# EAGLE design SparkFun_Ambient_Light_Sensor_VEML6030 (EAGLE 9.4.0)
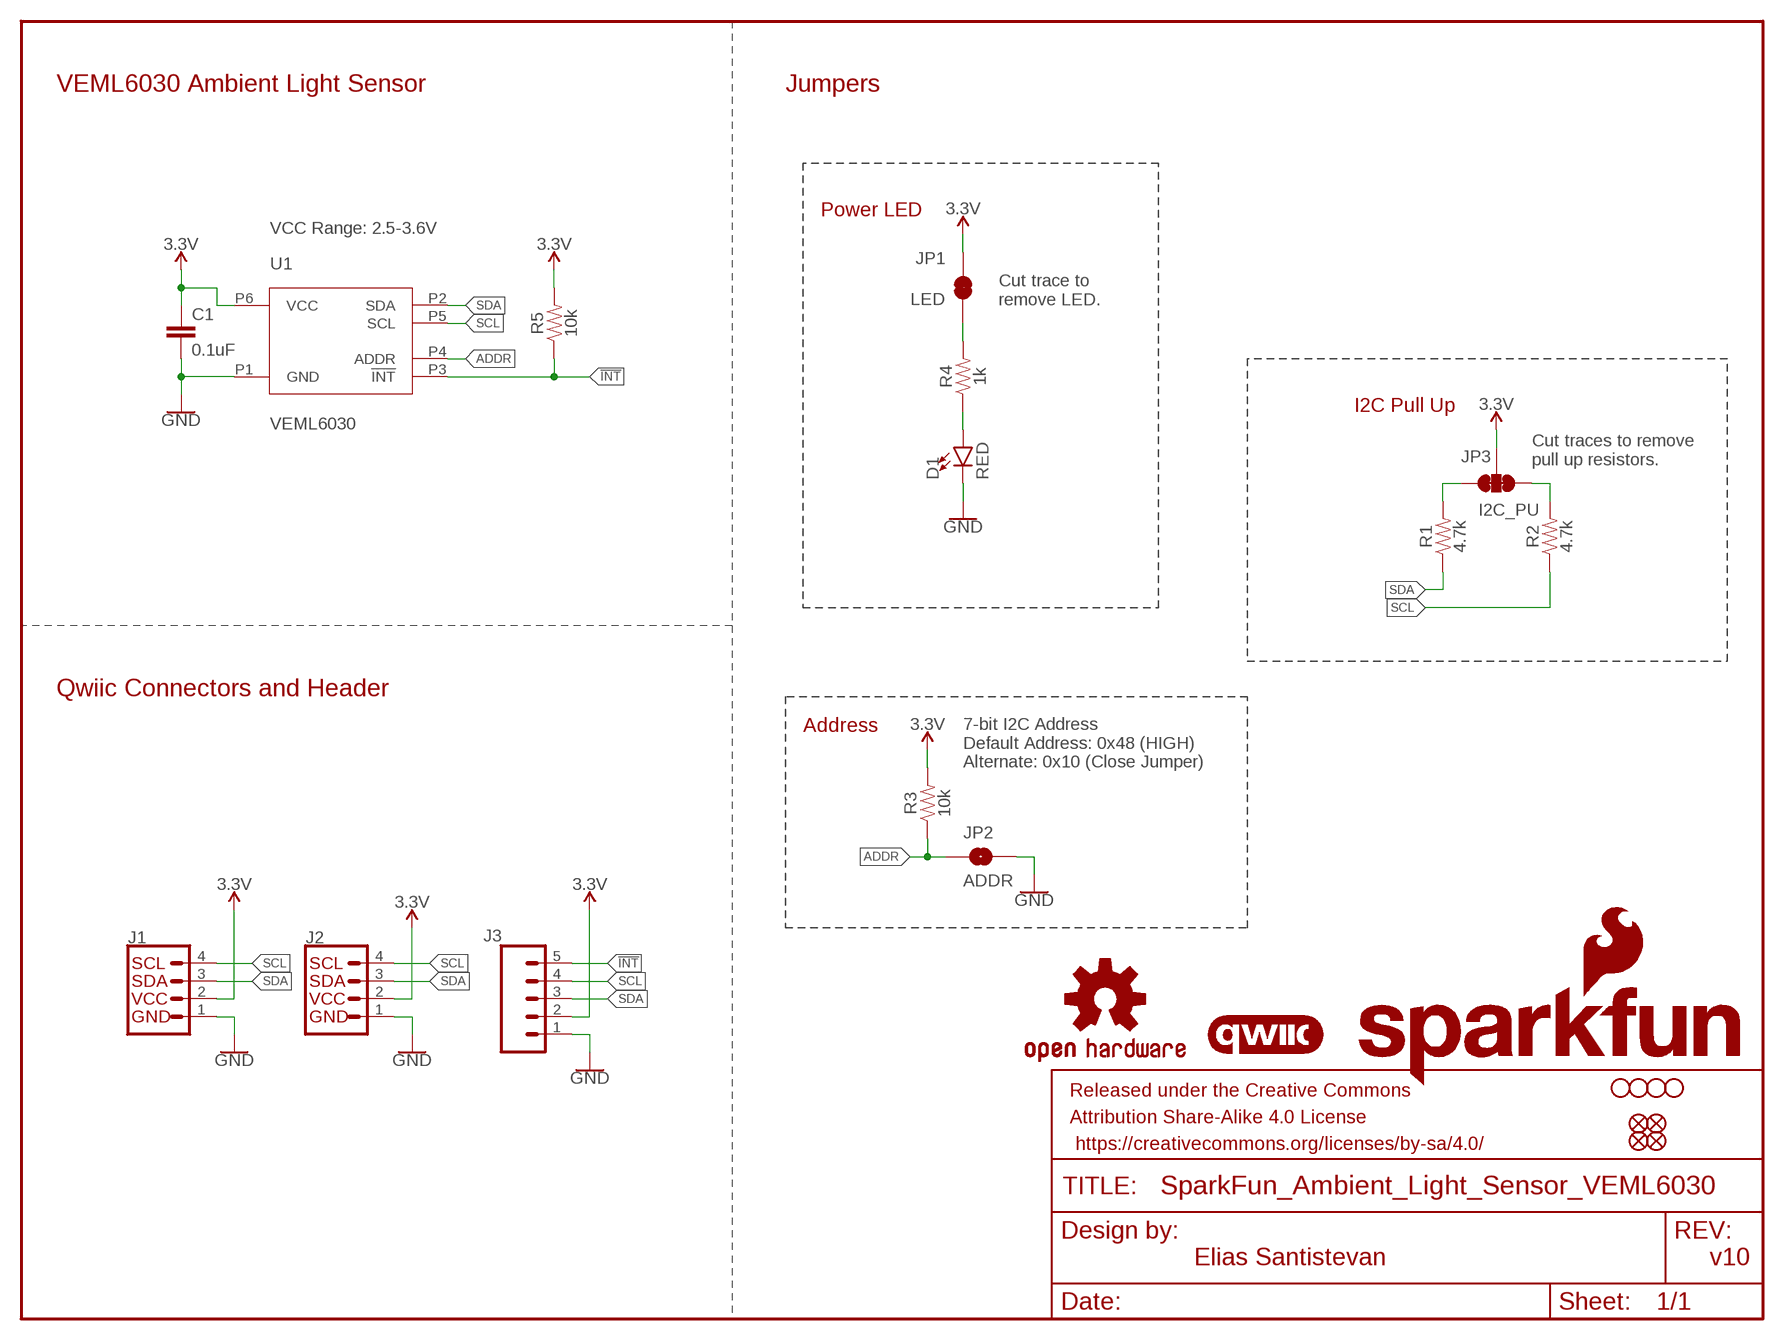
[diagram p0: schematic, sheet 1]

## Parts
C1  0.1uF  0.1UF-0603-25V-(+80/-20%)  [0603]
D1  RED  LED-RED0603  [LED-0603]
FD1  FIDUCIAL1X2  [FIDUCIAL-1X2]
FD2  FIDUCIAL1X2  [FIDUCIAL-1X2]
FD3  FIDUCIAL1X2  [FIDUCIAL-1X2]
FD4  FIDUCIAL1X2  [FIDUCIAL-1X2]
FRAME1  FRAME-LETTER  [CREATIVE_COMMONS]
H1  STAND-OFFTIGHT  [STAND-OFF-TIGHT]
H2  STAND-OFFTIGHT  [STAND-OFF-TIGHT]
H3  STAND-OFFTIGHT  [STAND-OFF-TIGHT]
H4  STAND-OFFTIGHT  [STAND-OFF-TIGHT]
J1  QWIIC_CONNECTORJS-1MM  [JST04_1MM_RA]
J2  QWIIC_CONNECTORJS-1MM  [JST04_1MM_RA]
J3  CONN_05NO_SILK  [1X05_NO_SILK]
JP1  LED  JUMPER-SMT_2_NC_TRACE_SILK  [SMT-JUMPER_2_NC_TRACE_SILK]
JP2  ADDR  JUMPER-SMT_2_NO_SILK  [SMT-JUMPER_2_NO_SILK]
JP3  I2C_PU  JUMPER-SMT_3_2-NC_TRACE_SILK  [SMT-JUMPER_3_2-NC_TRACE_SILK]
LOGO1  SFE_LOGO_NAME_FLAME.1_INCH  [SFE_LOGO_NAME_FLAME_.1]
LOGO2  OSHW-LOGOS  [OSHW-LOGO-S]
R1  4.7k  4.7KOHM-0603-1/10W-1%  [0603]
R2  4.7k  4.7KOHM-0603-1/10W-1%  [0603]
R3  10k  10KOHM-0603-1/10W-1%  [0603]
R4  1k  1KOHM-0603-1/10W-1%  [0603]
R5  10k  10KOHM-0603-1/10W-1%  [0603]
U1  VEML6030  [VEML6030]
U$1  QWIIC_LOGO_5MM  [QWIIC_5MM]

## Nets
3.3V: C1.1 J1.2 J2.2 J3.2 JP1.2 JP3.2 R3.2 R5.2 U1.P6(VCC)
!INT: J3.5 R5.1 U1.P3(!INT)
ADDR: JP2.1 R3.1 U1.P4(ADDR)
GND: C1.2 D1.C J1.1 J2.1 J3.1 JP2.2 U1.P1(GND)
N$1: D1.A R4.1
N$2: JP1.1 R4.2
N$3: JP3.3 R1.2
N$4: JP3.1 R2.2
SCL: J1.4 J2.4 J3.4 R2.1 U1.P5(SCL)
SDA: J1.3 J2.3 J3.3 R1.1 U1.P2(SDA)

## Notes on the sheet
- VEML6030 Ambient Light Sensor | Jumpers
- Power LED
- VCC Range: 2.5-3.6V
- Cut trace to 
  remove LED.
- I2C Pull Up
- Cut traces to remove 
  pull up resistors.
- Qwiic Connectors and Header
- Address
- 7-bit I2C Address
  Default Address: 0x48 (HIGH)
  Alternate: 0x10 (Close Jumper)
- Elias Santistevan | v10

## Library data of the parts
C1 = SparkFun-Capacitors:0.1UF: 0.1µF ceramic capacitors A capacitor is a passive two-terminal electrical component used to store electrical energy temporarily in an electric field.; PROD_ID: CAP-00810
D1 = SparkFun-LED:LED-RED: Red SMD LED Used in manufacturing of most products at SparkFun Packages: 0603 - SMD 0603 package [Product Link] <http://docs.avagotech.com/docs/AV02-0551EN> 0603 SMART - SMD 0603 SMART package ( more efficient and expensive)[Product Link] <http://www.osram-os.com/Graphics/XPic2/00077099_0.pdf> 1206 - SMD1206 package [Product Link] <https://www.sparkfun.com/datasheets/DevTools/LilyPad/Q150OVS4.pdff> SparkFun Products: Pro Mini 328 -5V <https://www.sparkfun.com/products/821> RedBoard <https://www.sparkfun.com/products/12757> IOIO-OTG <https://www.sparkfun.com/products/13613>; PROD_ID: DIO-00819
FD1-FD4 = SparkFun-Aesthetics:FIDUCIAL: Fiducial Alignment Points Point-of-reference for pick-and-place machines and other optical instruments.
FRAME1 = SparkFun-Aesthetics:FRAME-LETTER: Schematic Frame - Letter Standard 8.5x11 US Letter frame
H1-H4 = SparkFun-Hardware:STAND-OFF: Stand Off Drill holes for mechanically mounting via screws, standoffs, etc. Note: Use the keepout ring to avoid running the screw head into surrounding components. Variant Overviews STAND-OFF - Mechanical footprint for a #4 phillips button head screw. STAND-OFF-TIGHT - Mechanical footprint for a #4 phillips button head screw, Example SparkFun Products Screw - Phillips Head (1/4", 4-40, 10 pack) <https://www.sparkfun.com/products/10453> (PRT-10453) Screw - Phillips Head (1/2", 4-40, 10 pack) <https://www.sparkfun.com/products/10452> (PRT-10452) Screw - Phillips Head (3/4", 4-40, 10 pack) <https://www.sparkfun.com/products/10451> (PRT-10451) Screw - Phillips Head (1", 4-40, 10 pack) <https://www.sparkfun.com/products/10450> (PRT-10450)
J1 J2 = SparkFun-Connectors:QWIIC_CONNECTOR: SparkFun I2C Standard Qwiic Connector An SMD 1mm pitch JST connector makes it easy and quick (get it? Qwiic?) to connect I2C devices to each other. The Qwiic system <http://www.sparkfun.com/qwiic> enables fast and solderless connection between popular platforms and various sensors and actuators. We carry 200mm <https://www.sparkfun.com/products/14204>, 100mm <https://www.sparkfun.com/products/14205>, 50mm <https://www.sparkfun.com/products/14206>, and breadboard friendly <https://www.sparkfun.com/products/14207> Qwiic cables. We also offer 10 pcs strips <https://www.sparkfun.com/products/14323> the SMD connectors.; PROD_ID: CONN-13694
J3 = SparkFun-Connectors:CONN_05: Multi connection point. Often used as Generic Header-pin footprint for 0.1 inch spaced/style header connections On any of the 0.1 inch spaced packages, you can populate with these: Break Away Headers - Straight <https://www.sparkfun.com/products/116> (PRT-00116) Break Away Male Headers - Right Angle <https://www.sparkfun.com/products/553> (PRT-00553) Female Headers <https://www.sparkfun.com/products/115> (PRT-00115) Break Away Headers - Machine Pin <https://www.sparkfun.com/products/117> (PRT-00117) Break Away Female Headers - Swiss Machine Pin <https://www.sparkfun.com/products/743> (PRT-00743) For SCREWTERMINALS and SPRING TERMINALS visit here: Screw Terimnals on SparkFun.com <https://www.sparkfun.com/search/results?term=Screw+Terminals> (5mm/3.5mm/2.54mm spacing) This device is also useful as a general connection point to wire up your design to another part of your project. Our various solder wires solder well into these plated through hole pads. Hook-Up Wire - Assortment (Stranded, 22 AWG) <https://www.sparkfun.com/products/11375> (PRT-11375) Hook-Up Wire - Assortment (Solid Core, 22 AWG) <https://www.sparkfun.com/products/11367> (PRT-11367) View the entire wire category on our website here <https://www.sparkfun.com/categories/141> Special notes: Molex polarized connector foot print use with SKU : PRT-08231 with associated crimp pins and housings. 1MM SMD Version SKU: PRT-10208
JP1 = SparkFun-Jumpers:JUMPER-SMT_2_NC_TRACE: Normally closed trace jumper This jumper has a trace between two pads so it's normally closed (NC). Use a razor knife to open the connection. For best results follow the IPC guidelines for cutting traces: Cutout at least 0.063 mm (0.005 in). Remove all loose material to clean up the cut area. Seal the cut with an approved epoxy. Reapply solder to reclose the connection.
JP2 = SparkFun-Jumpers:JUMPER-SMT_2_NO: Normally open jumper This jumper has two pads in close proximity to each other. Apply solder to close the connection. Round pads are easier to solder for beginners, but are a lot larger. SparkFun Product that uses the round pads: SparkFun EL Sequencer <https://www.sparkfun.com/products/12781>
JP3 = SparkFun-Jumpers:JUMPER-SMT_3_2-NC_TRACE: Normally closed trace jumper (2 of 2 connections) This jumper has a trace between all three pads so they are normally closed (NC). Use a razor knife to open the connection(s). For best results follow the IPC guidelines for cutting traces: Cutout at least 0.063 mm (0.005 in). Remove all loose material to clean up the cut area. Seal the cut with an approved epoxy. Reapply solder to reclose the connection(s).
LOGO1 = SparkFun-Aesthetics:SFE_LOGO_NAME_FLAME: SparkFun Font Logo w/ Flame This is the SparkFun full logo. The logo on the schematic will always be the same size; the package variant is the height of the flame part of the logo. Default layer for the logo on the board is tSilk.
LOGO2 = SparkFun-Aesthetics:OSHW-LOGO: Open-Source Hardware (OSHW) Logo This logo indicates the piece of hardware it is found on incorporates a OSHW license and/or adheres to the definition of open source hardware found here: http://freedomdefined.org/OSHW
R1 R2 = SparkFun-Resistors:4.7KOHM: 4.7kΩ resistor A resistor is a passive two-terminal electrical component that implements electrical resistance as a circuit element. Resistors act to reduce current flow, and, at the same time, act to lower voltage levels within circuits. - Wikipedia; PROD_ID: RES-07857
R3 R5 = SparkFun-Resistors:10KOHM: 10kΩ resistor A resistor is a passive two-terminal electrical component that implements electrical resistance as a circuit element. Resistors act to reduce current flow, and, at the same time, act to lower voltage levels within circuits. - Wikipedia; PROD_ID: RES-00824
R4 = SparkFun-Resistors:1KOHM: 1kΩ resistor A resistor is a passive two-terminal electrical component that implements electrical resistance as a circuit element. Resistors act to reduce current flow, and, at the same time, act to lower voltage levels within circuits. - Wikipedia; PROD_ID: RES-07856
U1 = SparkFun-Sensors:VEML6030: VEML6030 Ambient Light Sensor VEML6030 is a high accuracy ambient light digital 16-bit resolution sensor in a miniature transparent 2 mm x 2 mm package. It includes a high sensitive photodiode, a low noise amplifier, a 16-bit A/D converter and supports an easy to use I2C bus communication interface and additional interrupt feature.; PROD_ID: SEN-14447
U$1 = SparkFun-Aesthetics:QWIIC_LOGO: Qwiic Logos for placement on schematic and PCB. The 5.5mm silk logo is best for placing next to Qwiic connector.

## Board
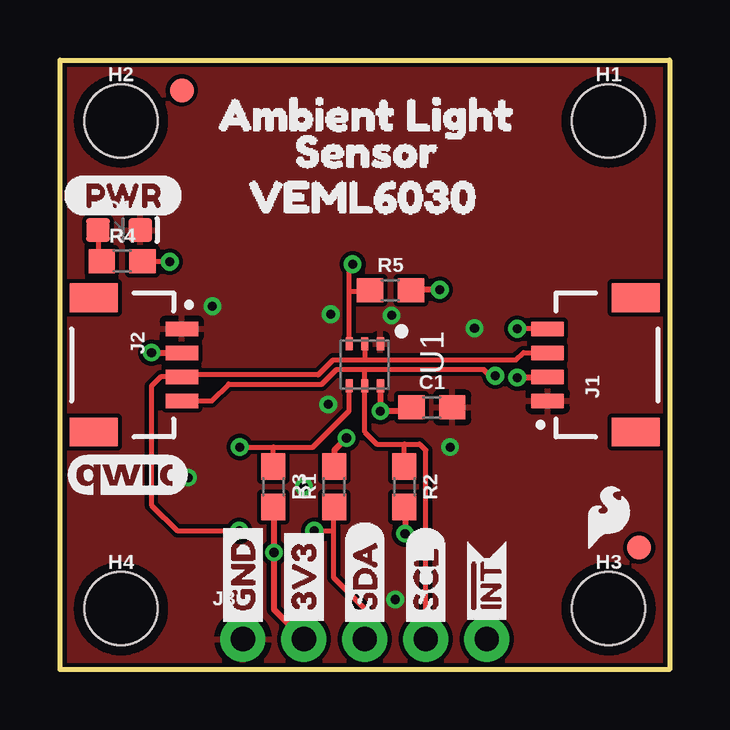
[diagram p1: board, top side]
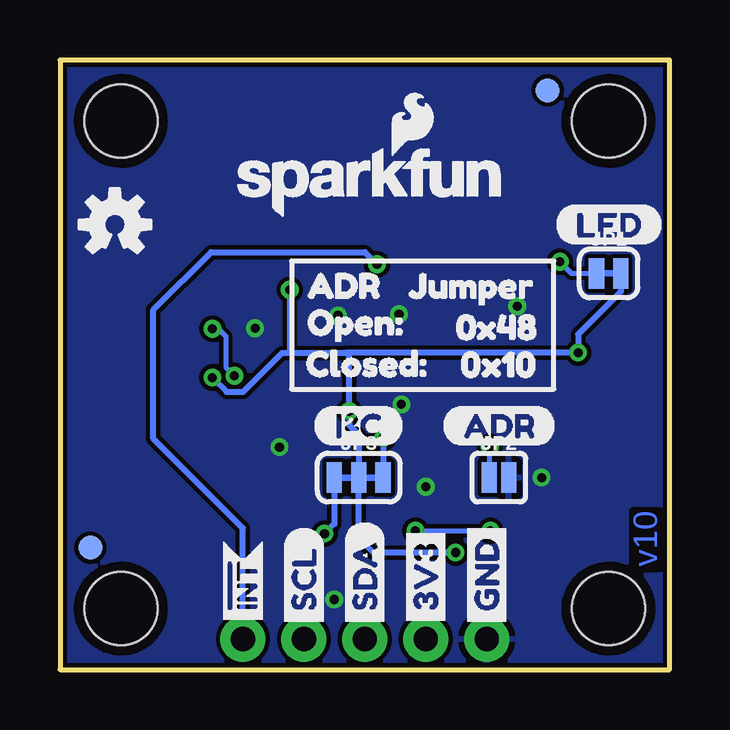
[diagram p2: board, bottom side, seen from below]

Size 25.4 x 25.4 mm. Coordinates in mm from the lower left corner, seen from the top.
Outline: 0,0 0,25.4 25.4,25.4 25.4,0 0,0
Copper layers (1*16): Top 0.035mm / dielectric 1.5mm / Bottom 0.035mm
Design rules "SparkFun-2-layer-TIGHT": minimum track width 7mil, minimum drill 15mil, track to track 7mil, track to pad 7mil, pad to pad 7mil, via to via 7mil, smd to smd 7mil, copper to edge 7mil, drill to drill 7mil, minimum pad ring 7mil, minimum via ring 7mil, stop-mask expansion 4mil, vias tented up to drill 25mil, thermal gap 10mil

### Footprints (pad centres in the part's own frame; a part is rotated, then mirrored left to right if it is on the bottom)
0603 = smd 1.1 x 1: 1 -0.85,0; 2 0.85,0
LED-0603 = smd 1 x 1: A -0.877,0; C 0.877,0
FIDUCIAL-1X2 = smd 1 x 1: 1 0,0
STAND-OFF-TIGHT = hole 3.048: 0,0
JST04_1MM_RA = smd 0.6 x 1.35: 1 -1.5,0; 2 -0.5,0; 3 0.5,0; 4 1.5,0 | smd 1.2 x 2: NC1 2.8,-3.675; NC2 -2.8,-3.675
1X05_NO_SILK = drill 1.016 pad 1.88: 1 0,0; 2 2.54,0; 3 5.08,0; 4 7.62,0; 5 10.16,0
SMT-JUMPER_2_NC_TRACE_SILK = smd 0.635 x 1.27: 1 -0.508,0; 2 0.508,0
SMT-JUMPER_2_NO_SILK = smd 0.635 x 1.27: 1 -0.406,0; 2 0.406,0
SMT-JUMPER_3_2-NC_TRACE_SILK = smd 0.635 x 1.27: 1 -1.016,0; 2 0,0; 3 1.016,0
VEML6030 = smd 0.55 x 0.3: P1 -0.88,0.65; P2 -0.88,0; P3 -0.88,-0.65; P4 0.87,-0.65; P5 0.87,0; P6 0.87,0.65

### Placement (x,y rotation side)
C1  15.49,10.92 0 top
D1  2.46,18.31 0 top
FD1  24.13,5.08 0 bottom
FD2  5.08,24.13 0 bottom
FD3  5.08,24.13 0 top
FD4  24.13,5.08 0 top
FRAME1  -5.08,-11.43 0 top  (outside the outline)
H1  22.86,22.86 0 top
H2  2.54,22.86 0 top
H3  22.86,2.54 0 top
H4  2.54,2.54 0 top
J1  20.32,12.7 90 top
J2  5.08,12.7 270 top
J3  7.62,1.27 0 top
JP1  2.54,16.51 0 bottom
JP2  7.11,8 0 bottom
JP3  12.95,8 0 bottom
LOGO1  12.45,20.32 0 bottom
LOGO2  23.11,18.54 0 bottom
R1  11.43,7.62 90 top
R2  14.35,7.62 270 top
R3  8.89,7.62 270 top
R4  2.59,17.02 0 top
R5  13.77,15.8 0 top
U1  12.7,12.7 270 top
U$1  2.79,8.13 0 top
U$2  [3V3-04]  10.16,1.52 90 top
U$3  [GND-04]  7.62,1.52 90 top
U$4  [SDA-[)]  12.7,1.52 90 top
U$5  [SCL-[)]  15.24,1.52 90 top
U$6  [INT#-[<]  17.78,1.4 90 top
U$7  [INT#-[<]  17.78,1.4 90 bottom
U$8  [GND-04]  7.62,1.52 90 bottom
U$9  [SDA-[)]  12.7,1.52 90 bottom
U$10  [SCL-[)]  15.24,1.52 90 bottom
U$11  [3V3-04]  10.16,1.52 90 bottom
U$12  [I_SUPER2_C-()-04]  14.86,10.16 0 bottom
U$13  [ADR-()]  9.53,10.16 0 bottom
U$14  [LED0]  4.83,18.54 0 bottom
U$15  [AMBIENT_LIGHT0]  5.46,23.11 0 top
U$16  [SENSOR1]  8.64,21.59 0 top
U$17  [VEML60302]  6.73,19.68 0 top
U$18  [SFE_LOGO_FLAME_.1]  22.86,6.35 0 top
U$19  [PWR-()-04]  0.13,19.76 0 top
U$20  [CLOSED#2]  16.05,12.75 0 bottom
U$21  [OPEN#0]  16,14.48 0 bottom
U$22  [0X481]  9.8,14.27 0 bottom
U$24  [0X103]  9.6,12.73 0 bottom
U$25  [ADR0]  16,16 0 bottom
U$26  [JUMPER1]  11.79,16 0 bottom

### Tracks (layer width: path | path; a pad name or v marks a point on that pad's centre or on a via)
3.3V  (via drill 0.38)
  Top 0.254: J1.2 20.29,12.17 v19.05,12.17 | v3.81,13.21 v3.81,13.2 J2.2 | U1.P6 v13.35,10.77 14.49,10.77 C1.1 | v15.82,15.82 14.64,15.82 R5.2 | R3.2 8.91,6.75 v8.91,4.88 8.91,2.52 J3.2
  Bottom 0.254: JP1.2 2.03,15.75 3.81,13.97 v3.81,13.21 13.49,13.21 13.46,13.18 | 13.46,13.18 15.75,13.18 | 15.75,13.18 16.15,13.18 17.77,11.57 18.45,11.57 v19.05,12.17 | 13.46,13.18 13.35,13.07 v13.35,10.77 13.35,10.19 12.95,9.79 JP3.2 12.95,5.49 12.34,4.88 v8.91,4.88 | v15.82,15.82 15.82,13.26 15.75,13.18
!INT  (via drill 0.38)
  Top 0.203: v12.19,16.89 12.05,16.75 12.05,15.75 | U1.P3 12.05,15.75 | R5.1 12.87,15.75 12.05,15.75
  Bottom 0.254: J3.5 17.78,5.89 21.51,9.63 21.51,14.99 19.1,17.4 12.7,17.4 v12.19,16.89
ADDR  (via drill 0.38)
  Top 0.203: U1.P4 12.05,10.78 10.54,9.27 8.89,9.27 | v7.49,9.27 8.89,9.27 | R3.1 8.89,9.27
  Bottom 0.203: v7.49,9.27 7.52,9.25 JP2.1
GND  (via drill 0.38)
  other vias: 6.35,15.14 16.26,9.27 10.16,7.62 5.33,8 13.97,2.92 17.27,14.22 11.18,11.05 11.28,14.81 13.82,14.76
  pour Top: 0,25.4 25.4,25.4 25.4,0 0,0
  pour Bottom: 0,25.4 25.4,25.4 25.4,0 0,0
N$1
  Top 0.203: D1.A 1.59,17.17 R4.1
N$2  (via drill 0.38)
  Top 0.203: v4.57,16.99 3.47,16.99 R4.2
  Bottom 0.203: v4.57,16.99 4.09,16.51 JP1.1
N$3  (via drill 0.38)
  Top 0.254: v11.94,9.65 11.43,9.14 R1.2
  Bottom 0.254: v11.94,9.65 JP3.3
N$4  (via drill 0.38)
  Top 0.254: R2.2 14.38,6.75 v14.38,5.66
  Bottom 0.254: JP3.1 13.97,6.07 v14.38,5.66
SCL  (via drill 0.38)
  Top 0.203: J1.4 v19.05,14.2 | J2.4 6.33,11.2 7.02,11.89 10.91,11.89 11.52,12.51 12.7,12.51 | 12.7,12.51 U1.P5 12.7,9.89 13.19,9.4 14.35,9.4 | v18.14,12.24 17.91,12.24 17.64,12.51 12.7,12.51 | J3.4 15.24,9.14 14.99,9.4 14.35,9.4 | R2.1 14.35,9.4
  Bottom 0.203: v18.14,12.24 18.49,12.6 18.49,13.89 18.8,14.2 v19.05,14.2
SDA  (via drill 0.38)
  Top 0.203: v7.47,5.79 4.88,5.79 3.81,6.86 3.81,11.81 4.2,12.2 J2.3 5.16,12.28 10.75,12.28 11.38,12.9 12.7,12.9 | J3.3 12.7,2.54 11.4,3.83 11.4,5.79 | J1.3 19.3,13.21 19,12.9 12.7,12.9 | U1.P2 12.7,12.9 | 11.4,5.79 11.4,6.75 R1.1 | v10.59,5.79 11.4,5.79
  Bottom 0.203: v10.59,5.79 v7.47,5.79

### Text on the board
Bottom: v10
tDocu: Elias Santistevan